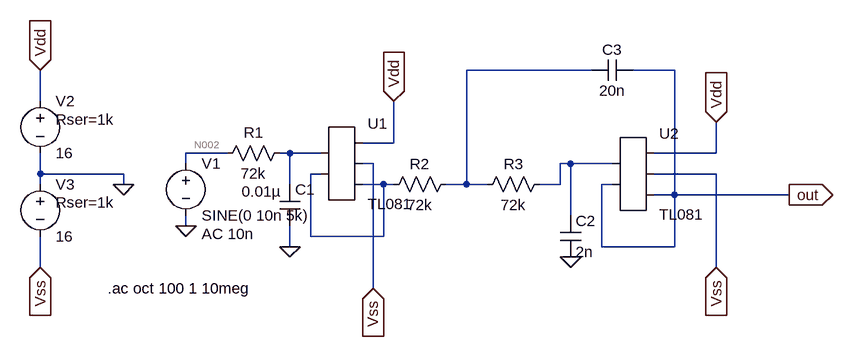
[diagram p0: schematic Chebyshev_3rd.asc]
* Chebyshev_3rd.asc
R1 N003 N002 72k tol=5 pwr=0.25
* U1: TL081 (symbol AutoGenerated\TL081 not available, pins judged from their places): pin1=N003 pin2=N005 pin3=Vdd pin4=Vss pin5=N005
* U2: TL081 (symbol AutoGenerated\TL081 not available, pins judged from their places): pin1=N004 pin2=out pin3=Vdd pin4=Vss pin5=out
R2 N001 N005 72k tol=5 pwr=0.25
R3 N004 N001 72k tol=5 pwr=0.25
C1 N003 0 0.01µ V=50 Rser=0.1
C2 N004 0 2n V=50 Rser=0.1
C3 out N001 20n V=50 Rser=0.1
V1 N002 0 SINE(0 10n 5k) AC 10n
V2 Vdd 0 16 Rser=1k
V3 0 Vss 16 Rser=1k
.ac oct 100 1 10meg
.backanno
.end

* Results of the author's LTspice run, read from the files saved beside the schematic
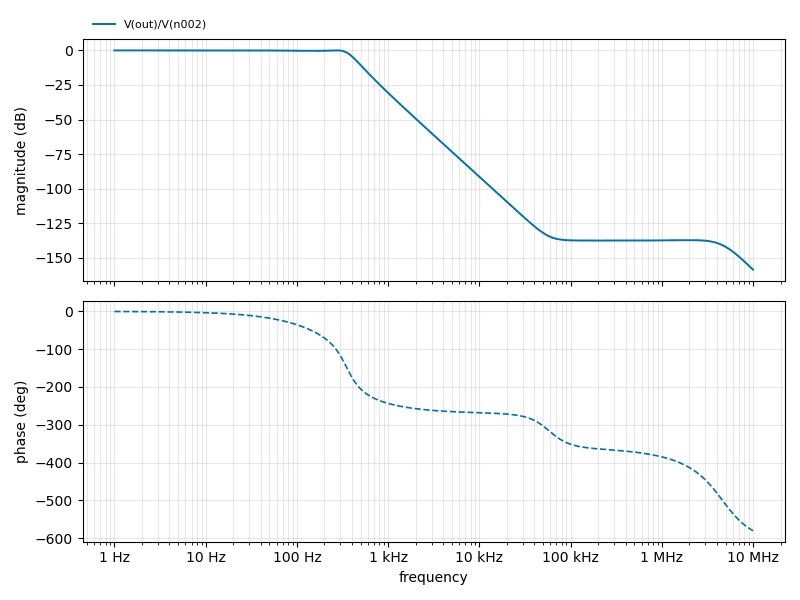
[diagram p1: AC Analysis of Chebyshev_3rd.asc, plotted from the saved traces]
* AC Analysis, 1 run:
*   V(out)/V(n002): -0.00 dB at 1 Hz, -158.53 dB at 10 MHz, peak 0.00 dB at 270.6 Hz, 3 dB below the peak at 379.9 Hz